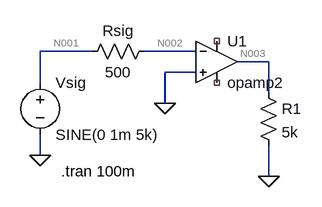
[diagram p0: schematic trycircuit.asc]
trycircuit.asc, the LTspice schematic file:
Version 4
SHEET 1 880 680
WIRE 48 112 -32 112
WIRE 208 112 128 112
WIRE 320 128 272 128
WIRE 208 144 160 144
WIRE -32 160 -32 112
WIRE 320 176 320 128
WIRE 160 192 160 144
WIRE -32 272 -32 240
WIRE 320 304 320 256
FLAG 160 192 0
FLAG -32 272 0
FLAG 320 304 0
SYMBOL res 144 96 R90
WINDOW 0 0 56 VBottom 2
WINDOW 3 32 56 VTop 2
SYMATTR InstName Rsig
SYMATTR Value 500
SYMBOL voltage -32 144 R0
WINDOW 123 0 0 Left 0
WINDOW 39 0 0 Left 0
SYMATTR InstName Vsig
SYMATTR Value SINE(0 1m 5k)
SYMBOL res 304 160 R0
SYMATTR InstName R1
SYMATTR Value 5k
SYMBOL OpAmps\\opamp2 240 64 R0
SYMATTR InstName U1
TEXT 0 296 Left 2 !.tran 100m

The netlist it stands for:
* trycircuit.asc
Rsig N002 N001 500
Vsig N001 0 SINE(0 1m 5k)
R1 N003 0 5k
XU1 0 N002 NC_01 NC_02 N003 opamp2  ; pins In+ In- V+ V- OUT
.tran 100m
.backanno
.end

* Results of the author's LTspice run, read from the files saved beside the schematic
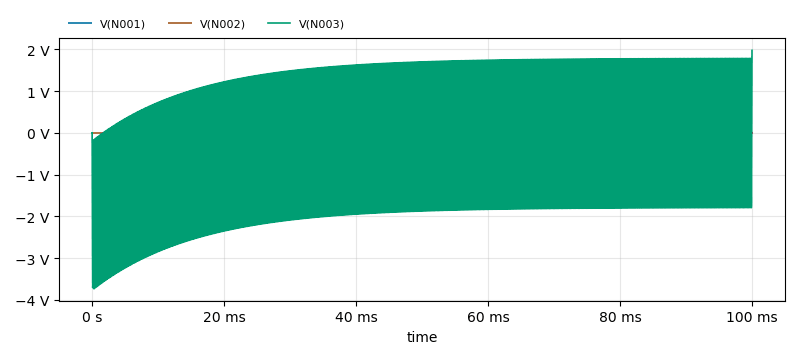
[diagram p1: Transient Analysis of trycircuit.asc, plotted from the saved traces]
* Transient Analysis, 1 run:
*   V(N001): min -999.5 µV, max 999.5 µV, average 25.1 nV, rms 718.4 µV, last 0 V
*   V(N002): min -996.8 µV, max 996.8 µV, average 27.31 nV, rms 705.5 µV, last 0 V
*   V(N003): min -3.738 V, max 1.978 V, average -315.2 mV, rms 1.414 V, last 1.978 V